# EAGLE schematic test (EAGLE 6.4)
PyRadio
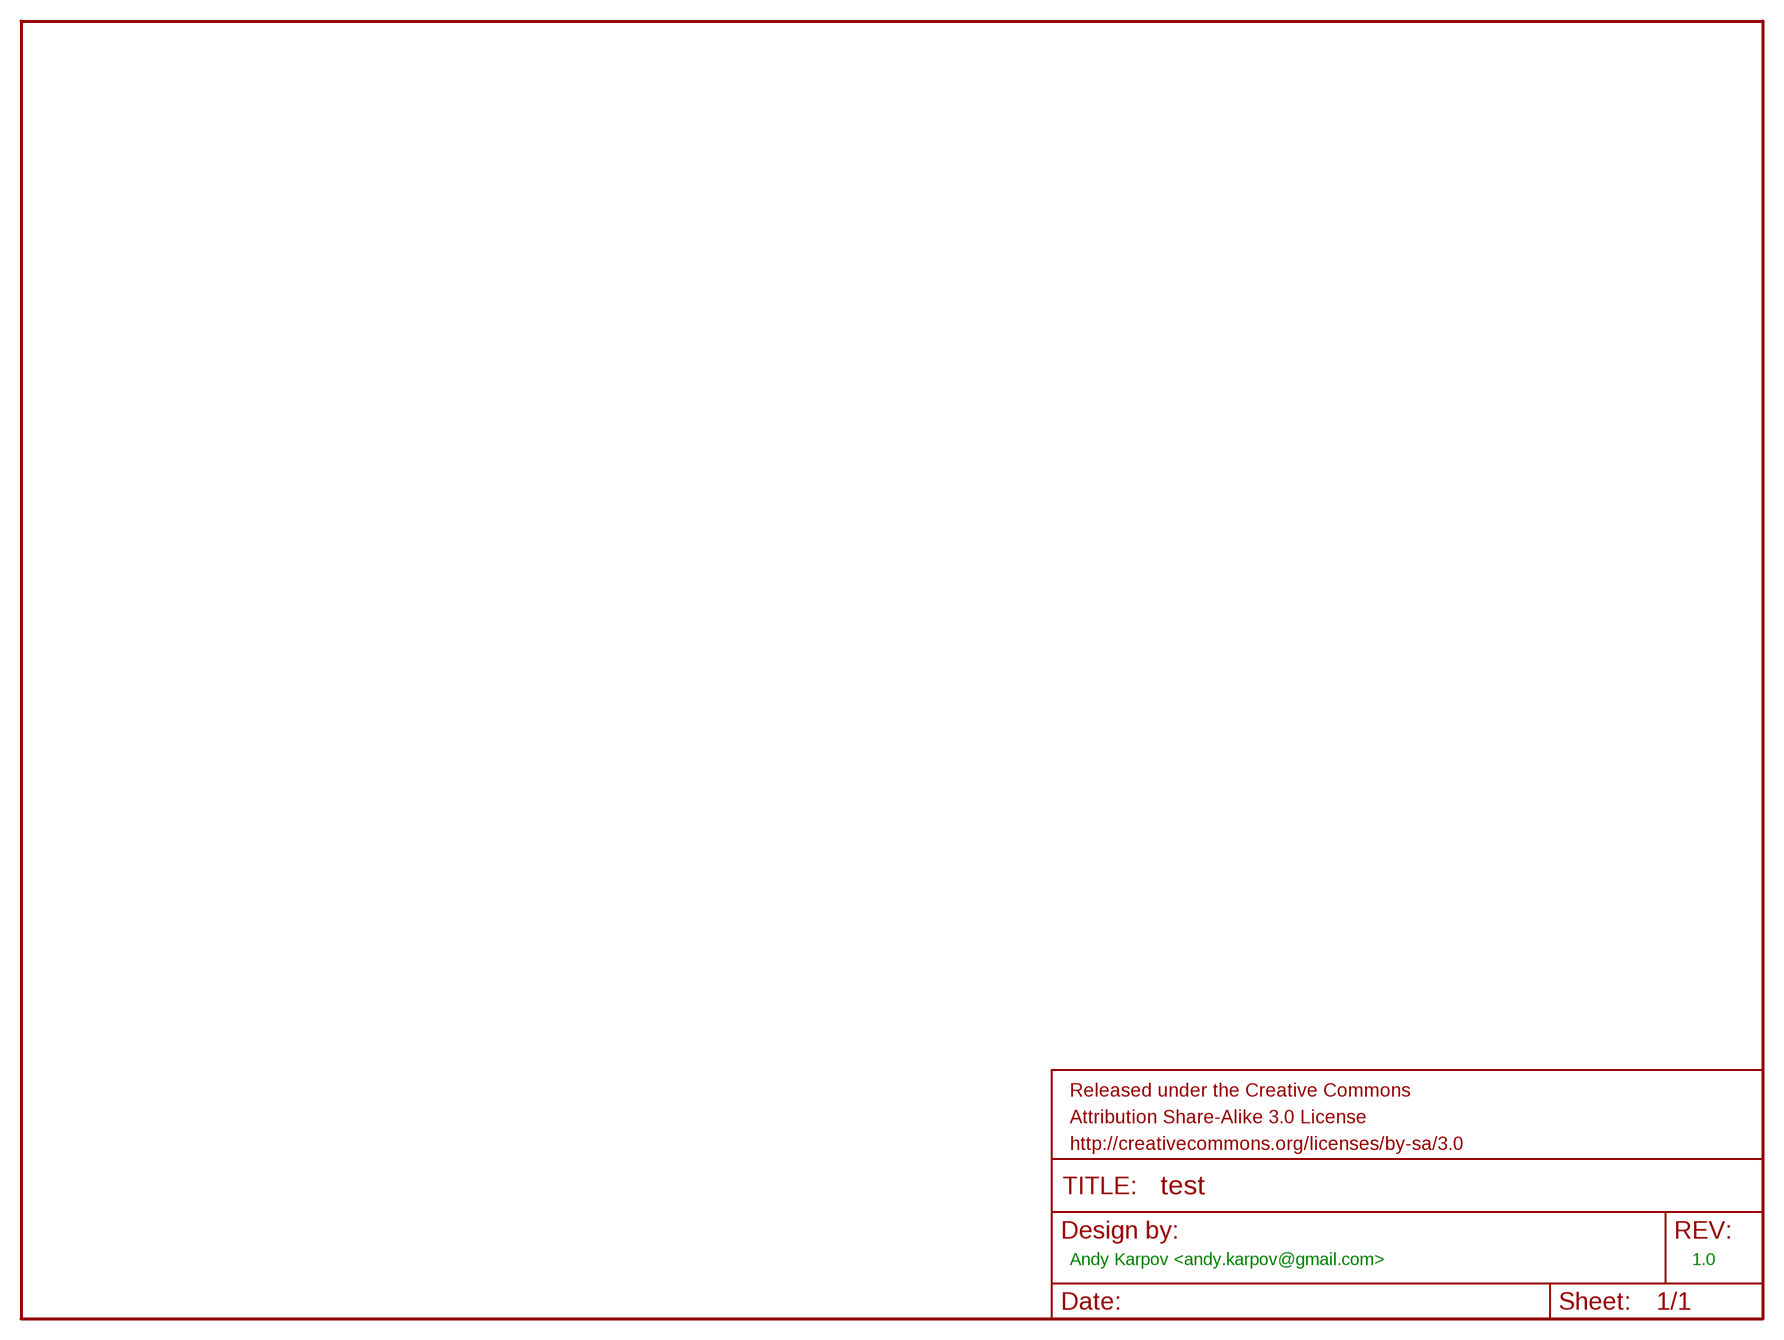
[diagram p0: schematic, sheet 1]

## Parts
FRAME1  FRAME-LETTER  [CREATIVE_COMMONS]

## Notes on the sheet
- Andy Karpov <andy.karpov@gmail.com> | 1.0

## Library data of the parts
FRAME1 = SparkFun-Aesthetics:FRAME-LETTER: Schematic Frame Standard 8.5x11 US Letter frame